# Altium schematic sheet Sensor_Recalibration_Circuit.SchDoc
size A
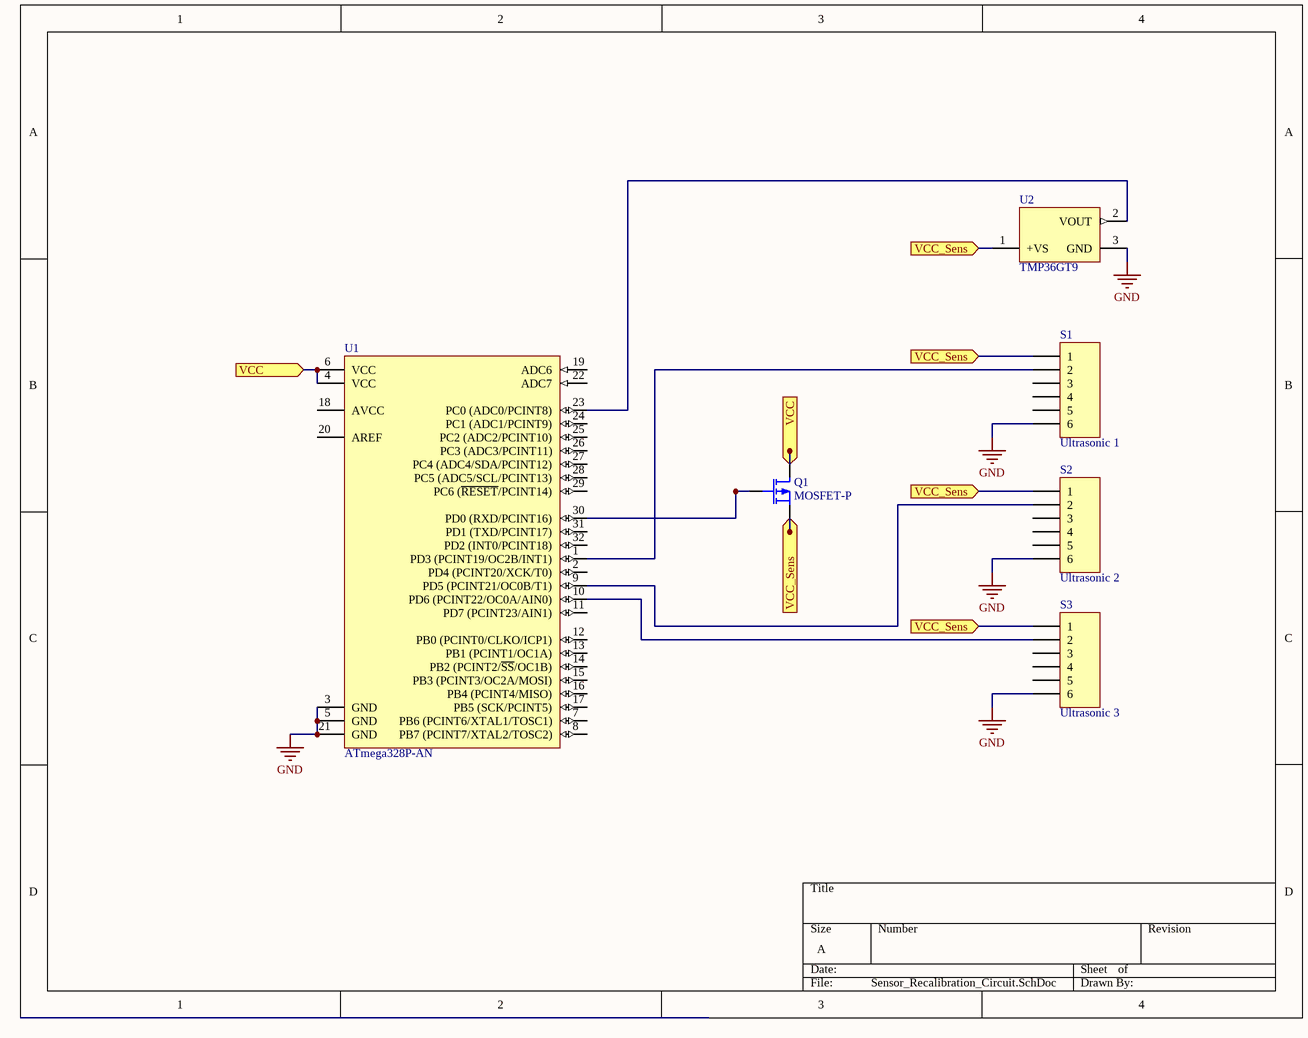
[diagram p0: Sensor_Recalibration_Circuit.SchDoc]

## Parts
Q1  MOSFET-P  [E3]
S1  Ultrasonic 1  [HDR1X6]
S2  Ultrasonic 2  [HDR1X6]
S3  Ultrasonic 3  [HDR1X6]
U1  ATmega328P-AN  [32A_N]
U2  TMP36GT9  [ADI-T-3]

## Ports
VCC (in), VCC_Sens (in)

## Nets
GND: S1.6 S2.6 S3.6 U1.3(GND) U1.5(GND) U1.21(GND) U2.3(GND)
VCC: Q1.1(D) U1.4(VCC) U1.6(VCC) ; port VCC
VCC_Sens: Q1.3(S) S1.1 S2.1 S3.1 U2.1(+VS) ; port VCC_Sens
NetQ1_2: Q1.2(G) U1.30(PD0_(RXD/PCINT16))
NetS1_2: S1.2 U1.1(PD3_(PCINT19/OC2B/INT1))
NetS2_2: S2.2 U1.9(PD5_(PCINT21/OC0B/T1))
NetS3_2: S3.2 U1.10(PD6_(PCINT22/OC0A/AIN0))
NetU1_23: U1.23(PC0_(ADC0/PCINT8)) U2.2(VOUT)

Not connected (* = marked no-connect by the designer): S1 3 4 5; S2 3 4 5; S3 3 4 5; U1 2(PD4_(PCINT20/XCK/T0)) 7(PB6_(PCINT6/XTAL1/TOSC1)) 8(PB7_(PCINT7/XTAL2/TOSC2)) 11(PD7_(PCINT23/AIN1)) 12(PB0_(PCINT0/CLKO/ICP1)) 13(PB1_(PCINT1/OC1A)) 14(PB2_(PCINT2/~{SS}/OC1B)) 15(PB3_(PCINT3/OC2A/MOSI)) 16(PB4_(PCINT4/MISO)) 17(PB5_(SCK/PCINT5)) 18(AVCC) 19(ADC6) 20(AREF) 22(ADC7) 24(PC1_(ADC1/PCINT9)) 25(PC2_(ADC2/PCINT10)) 26(PC3_(ADC3/PCINT11)) 27(PC4_(ADC4/SDA/PCINT12)) 28(PC5_(ADC5/SCL/PCINT13)) 29(PC6_(~{RESET}/PCINT14)) 31(PD1_(TXD/PCINT17)) 32(PD2_(INT0/PCINT18))

## Library data of the parts
Q1 = MOSFET-P: P-Channel MOSFET; Published: 8-Jun-2000; LatestRevisionDate: 17-Jul-2002; LatestRevisionNote: Re-released for DXP Platform.; PackageVersion: 1995/1996; PackageReference: E3; Publisher: Altium Limited; PackageDescription: TO, Flat Index; 3 In-Line, Axial Leads; Body Dia. 4.6mm; Lead Dia. 0.5 mm (max)
S1-S3 = Header 6: Header, 6-Pin; LatestRevisionDate: 17-Jul-2002; LatestRevisionNote: Re-released for DXP Platform.; Publisher: Altium Limited
U1 = ATmega328P-AN: 8-bit AVR Microcontroller, 32KB Flash, 1KB EEPROM, 2KB SRAM, 32-pin TQFP, Industrial Grade (-40°C to 105°C); DatasheetVersion: revD, May-2011; PackageVersion: revC, Oct-2010; PackageReference: 32A; PackageDescription: 32-Lead, 7x7x1.0 mm Body, 0.8mm Lead Pitch, Thin Profile Plastic Quad Flat Package (TQFP); Code_JEDEC: MS-026-ABA; ComponentLink1Description: Manufacturer URL; ComponentLink1URL: http://www.atmel.com/; ComponentLink2Description: ATmega48A/48PA/88A/88PA/168A/168PA/328/328P Datasheet; ComponentLink2URL: http://www.atmel.com/dyn/resources/prod_documents/8271.pdf; ComponentLink3Description: ATmega48A/48PA/88A/88PA/168A/168PA/328/328P Summary; ComponentLink3URL: http://www.atmel.com/dyn/resources/prod_documents/8271S.pdf
U2 = TMP36GT9: Low Voltage Temperature Sensor, 2.7 to 5.5 V Supply, Industrial, 3-pin TO92 (T-3), Tray; Manufacturer: Analog Devices; DatasheetVersion: Rev. F; PackageVersion: 042208-A, 04/2008; PackageReference: T-3; PackageDescription: 3-Pin Plastic Header-Style Package, 1.27 mm Pitch; Supplier 1: Mouser; Supplier Part Number 1: 584-TMP36GT9; Packing: Tray; Supply Voltage Range: 2.7 to 5.5 V; Mounting Technology: Through Hole; Code_JEDEC: TO-226-AA; PartNumber: TMP36GT9; ComponentLink1Description: Manufacturer URL; ComponentLink1URL: http://www.analog.com/en/index.html; ComponentLink2Description: Datasheet; ComponentLink2URL: http://www.analog.com/static/imported-files/data_sheets/TMP35_36_37.pdf; ComponentLink3Description: Package Specification; ComponentLink3URL: http://www.analog.com/static/imported-files/packages/PKG_PDF/TO-92(T)/T_3.pdf; ComponentLink4Description: Product URL; ComponentLink4URL: http://www.analog.com/en/mems-sensors/digital-temperature-sensors/tmp36/products/product.html